# Altium schematic sheet Motor_3.SchDoc
size A; SheetNumber: 4; SheetTotal: 4
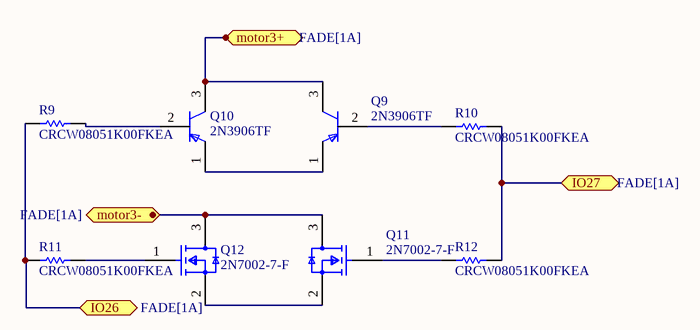
[diagram p0: Motor_3.SchDoc]

## Parts
Q9  2N3906TF  [FP-135AR-MFG]
Q10  2N3906TF  [FP-135AR-MFG]
Q11  2N7002-7-F  [FP-SOT23-MFG]
Q12  2N7002-7-F  [FP-SOT23-MFG]
R9  CRCW08051K00FKEA  [RESC2013X50X30NL20T20]
R10  CRCW08051K00FKEA  [RESC2013X50X30NL20T20]
R11  CRCW08051K00FKEA  [RESC2013X50X30NL20T20]
R12  CRCW08051K00FKEA  [RESC2013X50X30NL20T20]

## Ports
IO26 (bidir, see FADE[1A]), IO27 (bidir, see FADE[1A]), motor3+ (bidir, see FADE[1A]), motor3- (bidir, see FADE[1A])

## Nets
IO26: R9.1 R11.1 ; port IO26
IO27: R10.2 R12.2 ; port IO27
motor3+: Q9.3(C) Q10.3(C) ; port motor3+
motor3-: Q11.3(D) Q12.3(D) ; port motor3-
NetQ9_1: Q9.1(E) Q10.1(E)
NetQ9_2: Q9.2(B) R10.1
NetQ10_2: Q10.2(B) R9.2
NetQ11_1: Q11.1(G) R12.1
NetQ11_2: Q11.2(S) Q12.2(S)
NetQ12_1: Q12.1(G) R11.2

## Library data of the parts
Q9 Q10 = CMP-00278-84408866-1: 2N3906TF Small Signal Bipolar Transistor, 0.2A I(C), 40V V(BR)CEO, 1-Element, PNP, Silicon, TO-92; Manufacturer Lifecycle Status: ACTIVE; Collector Base Voltage (VCBO): -40V; Frequency: 250MHz; Number of Elements: 1; Max Power Dissipation: 625mW; Max Breakdown Voltage: 160V; Current Rating: -200mA; Emitter Base Voltage (VEBO): -5V; Collector Emitter Saturation Voltage: -400mV; Element Configuration: Single; Max Junction Temperature (Tj): 150°C; hFE Min: 100; Polarity: PNP; Lead Free: Lead Free; RoHS: Compliant; Max Operating Temperature: 150°C; Collector Emitter Voltage (VCEO): -40V; Max Frequency: 250MHz; Power Dissipation: 625mW; Height: 5.33mm; Schedule B: 8541210080; Mount: Through Hole; Length: 5.2mm; REACH SVHC: No SVHC; Min Operating Temperature: -55°C; Gain Bandwidth Product: 250MHz; Number of Pins: 3; Lifecycle Status: Production; Transition Frequency: 250MHz; NexarPartId: 84408866; Collector Emitter Breakdown Voltage: -40V; Case/Package: TO-92; Packaging: Tape and Reel; Width: 4.19mm; Max Collector Current: -200mA; Radiation Hardening: No; Weight: 240mg; Voltage Rating (DC): -40V
Q11 Q12 = CMP-2000-04929-2: MOSFET N-CH 60V 115MA SOT23-3; Turn-On Delay Time: 7ns; Turn-Off Delay Time: 11ns; Drain to Source Resistance: 7.5R; Rise Time: 3ns; Drain to Source Breakdown Voltage: 70V; Input Capacitance: 50pF; Number of Elements: 1; Power Dissipation: 540mW; Max Power Dissipation: 300mW; Fall Time: 5.6ns; Gate to Source Voltage (Vgs): 20V; Threshold Voltage: 2.5V; Element Configuration: Single; Termination: SMD/SMT; Weight: 0.000282oz; Radiation Hardening: No; Max Operating Temperature: 150°C; On-State Resistance: 7.5R; Mount: Surface Mount; Current Rating: 115mA; Contact Plating: Tin; Lead Free: Lead Free; Min Operating Temperature: -55°C; Number of Pins: 3; REACH SVHC: No SVHC; Drain to Source Voltage (Vdss): 60V; Width: 1.3mm; Package Quantity: 3000; Length: 2.9mm; Case/Package: SOT-23; Number of Channels: 1; Dual Supply Voltage: 60V; Packaging: Tape and Reel; Height: 1mm; Voltage Rating (DC): 60V; Nominal Vgs: 2.5V; Continuous Drain Current (ID): 115mA; Voltage: 60V; Rds On Max: 7.5R
R9-R12 = CMP-1013-00510-2: Manufacturer: Vishay Dale; Part Number: CRCW08051K00FKEA